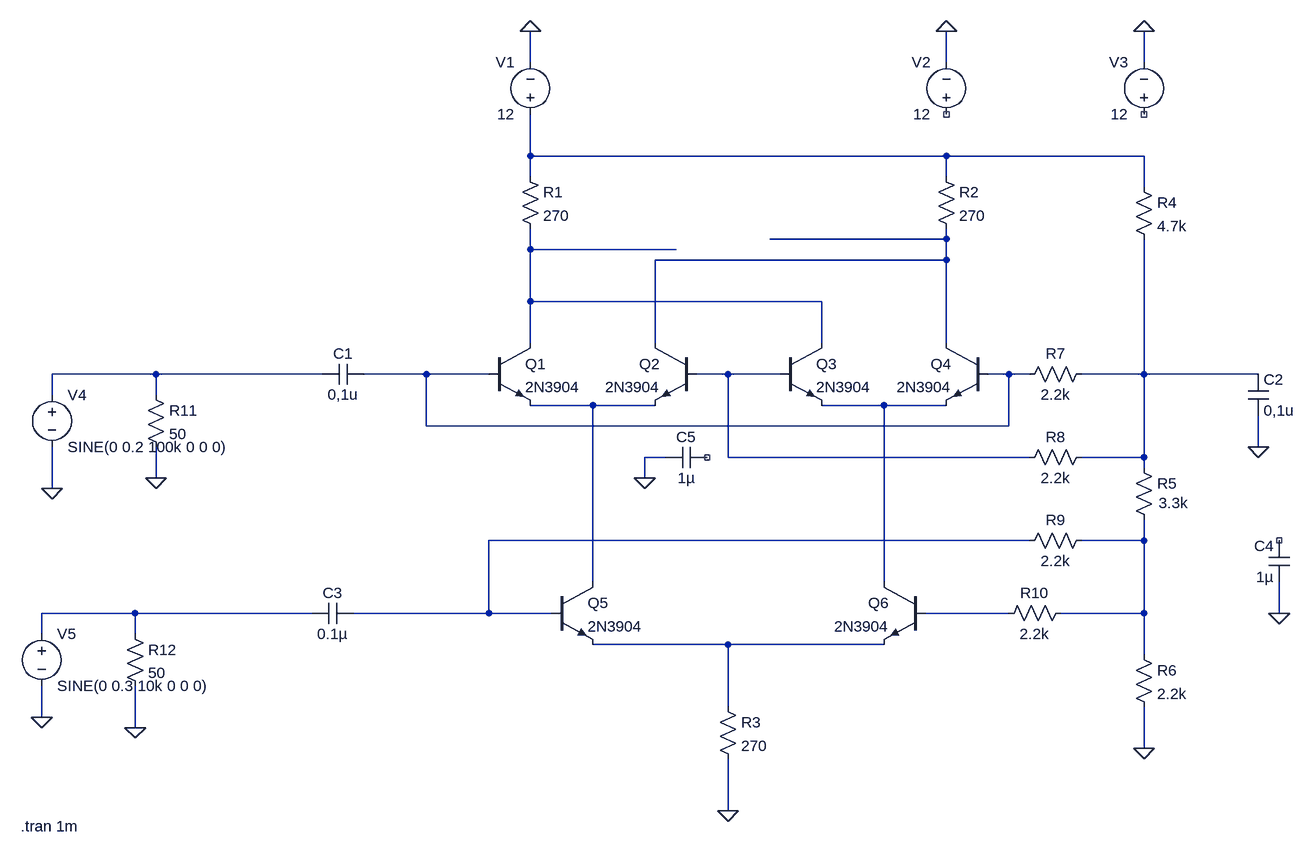
[diagram p0: schematic Gilbert Multiplier V1.asc]
Gilbert Multiplier V1.asc, the LTspice schematic file:
Version 4
SHEET 1 1092 1016
WIRE -224 -176 -224 -224
WIRE 416 -176 416 -224
WIRE 720 -176 720 -224
WIRE -224 -32 -224 -96
WIRE 416 -32 -224 -32
WIRE 720 -32 416 -32
WIRE -224 0 -224 -32
WIRE 416 0 416 -32
WIRE 720 16 720 -32
WIRE 416 96 416 80
WIRE 416 96 144 96
WIRE -224 112 -224 80
WIRE 0 112 -224 112
WIRE 416 128 416 96
WIRE 416 128 -32 128
WIRE -224 192 -224 112
WIRE 224 192 -224 192
WIRE -224 256 -224 192
WIRE -32 256 -32 128
WIRE 224 256 224 192
WIRE 416 256 416 128
WIRE -800 304 -960 304
WIRE -544 304 -800 304
WIRE -384 304 -480 304
WIRE -288 304 -384 304
WIRE 80 304 32 304
WIRE 160 304 80 304
WIRE 512 304 480 304
WIRE 544 304 512 304
WIRE 720 304 720 96
WIRE 720 304 624 304
WIRE 896 304 720 304
WIRE -960 336 -960 304
WIRE -800 336 -800 304
WIRE -128 352 -224 352
WIRE -32 352 -128 352
WIRE 320 352 224 352
WIRE 416 352 320 352
WIRE -384 384 -384 304
WIRE 512 384 512 304
WIRE 512 384 -384 384
WIRE 896 416 896 368
WIRE -16 432 -48 432
WIRE 80 432 80 304
WIRE 544 432 80 432
WIRE 720 432 720 304
WIRE 720 432 624 432
WIRE 720 448 720 432
WIRE -800 464 -800 416
WIRE -48 464 -48 432
WIRE -960 480 -960 416
WIRE 544 560 -288 560
WIRE 720 560 720 528
WIRE 720 560 624 560
WIRE -128 624 -128 352
WIRE 320 624 320 352
WIRE -832 672 -976 672
WIRE -560 672 -832 672
WIRE -288 672 -288 560
WIRE -288 672 -496 672
WIRE -192 672 -288 672
WIRE 512 672 384 672
WIRE 720 672 720 560
WIRE 720 672 592 672
WIRE 928 672 928 624
WIRE -976 704 -976 672
WIRE -832 704 -832 672
WIRE 80 720 -128 720
WIRE 320 720 80 720
WIRE 720 736 720 672
WIRE 80 816 80 720
WIRE -976 832 -976 784
WIRE -832 848 -832 784
WIRE 720 880 720 816
WIRE 80 976 80 896
FLAG -224 -224 0
FLAG 416 -224 0
FLAG 720 -224 0
FLAG 720 880 0
FLAG 80 976 0
FLAG 896 416 0
FLAG 928 672 0
FLAG -48 464 0
FLAG -960 480 0
FLAG -976 832 0
FLAG -800 464 0
FLAG -832 848 0
SYMBOL res -240 -16 R0
SYMATTR InstName R1
SYMATTR Value 270
SYMBOL res 400 -16 R0
SYMATTR InstName R2
SYMATTR Value 270
SYMBOL res 64 800 R0
SYMATTR InstName R3
SYMATTR Value 270
SYMBOL res 704 0 R0
SYMATTR InstName R4
SYMATTR Value 4.7k
SYMBOL res 704 432 R0
WINDOW 3 39 70 Left 2
SYMATTR Value 3.3k
SYMATTR InstName R5
SYMBOL res 704 720 R0
SYMATTR InstName R6
SYMATTR Value 2.2k
SYMBOL res 640 288 R90
WINDOW 0 0 56 VBottom 2
WINDOW 3 32 56 VTop 2
SYMATTR InstName R7
SYMATTR Value 2.2k
SYMBOL res 640 416 R90
WINDOW 0 0 56 VBottom 2
WINDOW 3 32 56 VTop 2
SYMATTR InstName R8
SYMATTR Value 2.2k
SYMBOL res 640 544 R90
WINDOW 0 0 56 VBottom 2
WINDOW 3 32 56 VTop 2
SYMATTR InstName R9
SYMATTR Value 2.2k
SYMBOL res 608 656 R90
WINDOW 0 0 56 VBottom 2
WINDOW 3 32 56 VTop 2
SYMATTR InstName R10
SYMATTR Value 2.2k
SYMBOL npn -288 256 R0
SYMATTR InstName Q1
SYMATTR Value 2N3904
SYMBOL npn 32 256 M0
SYMATTR InstName Q2
SYMATTR Value 2N3904
SYMBOL npn 160 256 R0
SYMATTR InstName Q3
SYMATTR Value 2N3904
SYMBOL npn 480 256 M0
SYMATTR InstName Q4
SYMATTR Value 2N3904
SYMBOL voltage -224 -80 R180
WINDOW 0 24 96 Left 2
WINDOW 3 24 16 Left 2
WINDOW 123 0 0 Left 0
WINDOW 39 0 0 Left 0
SYMATTR InstName V1
SYMATTR Value 12
SYMBOL voltage 416 -80 R180
WINDOW 0 24 96 Left 2
WINDOW 3 24 16 Left 2
WINDOW 123 0 0 Left 0
WINDOW 39 0 0 Left 0
SYMATTR InstName V2
SYMATTR Value 12
SYMBOL voltage 720 -80 R180
WINDOW 0 24 96 Left 2
WINDOW 3 24 16 Left 2
WINDOW 123 0 0 Left 0
WINDOW 39 0 0 Left 0
SYMATTR InstName V3
SYMATTR Value 12
SYMBOL voltage -960 320 R0
WINDOW 123 0 0 Left 0
WINDOW 39 0 0 Left 0
SYMATTR InstName V4
SYMATTR Value SINE(0 0.2 100k 0 0 0)
SYMBOL voltage -976 688 R0
WINDOW 123 0 0 Left 0
WINDOW 39 0 0 Left 0
SYMATTR InstName V5
SYMATTR Value SINE(0 0.3 10k 0 0 0)
SYMBOL npn -192 624 R0
SYMATTR InstName Q5
SYMATTR Value 2N3904
SYMBOL npn 384 624 M0
SYMATTR InstName Q6
SYMATTR Value 2N3904
SYMBOL cap -480 288 R90
WINDOW 0 0 32 VBottom 2
WINDOW 3 32 32 VTop 2
SYMATTR InstName C1
SYMATTR Value 0,1u
SYMBOL cap 880 304 R0
SYMATTR InstName C2
SYMATTR Value 0,1u
SYMBOL cap -496 656 R90
WINDOW 0 0 32 VBottom 2
WINDOW 3 32 32 VTop 2
SYMATTR InstName C3
SYMATTR Value 0.1µ
SYMBOL cap 944 624 R180
WINDOW 0 24 56 Left 2
WINDOW 3 24 8 Left 2
SYMATTR InstName C4
SYMATTR Value 1µ
SYMBOL cap 48 416 R90
WINDOW 0 0 32 VBottom 2
WINDOW 3 32 32 VTop 2
SYMATTR InstName C5
SYMATTR Value 1µ
SYMBOL res -816 320 R0
SYMATTR InstName R11
SYMATTR Value 50
SYMBOL res -848 688 R0
SYMATTR InstName R12
SYMATTR Value 50
TEXT -1008 1000 Left 2 !.tran 1m

The netlist it stands for:
* Gilbert Multiplier V1.asc
R1 N001 N003 270
R2 N001 N002 270
R3 N014 0 270
R4 N001 N007 4.7k
R5 N007 N011 3.3k
R6 N011 0 2.2k
R7 N007 N005 2.2k
R8 N007 N006 2.2k
R9 N011 N010 2.2k
R10 N011 N013 2.2k
Q1 N003 N005 N008 0 2N3904
Q2 N002 N006 N008 0 2N3904
Q3 N003 N006 N009 0 2N3904
Q4 N002 N005 N009 0 2N3904
V1 N001 0 12
V2 NC_01 0 12
V3 NC_02 0 12
V4 N004 0 SINE(0 0.2 100k 0 0 0)
V5 N012 0 SINE(0 0.3 10k 0 0 0)
Q5 N008 N010 N014 0 2N3904
Q6 N009 N013 N014 0 2N3904
C1 N005 N004 0,1u
C2 N007 0 0,1u
C3 N010 N012 0.1µ
C4 0 NC_03 1µ
C5 NC_04 0 1µ
R11 N004 0 50
R12 N012 0 50
.model NPN NPN
.model PNP PNP
.lib standard.bjt
.tran 1m
.backanno
.end